# Altium project HVPCB.PrjPCB
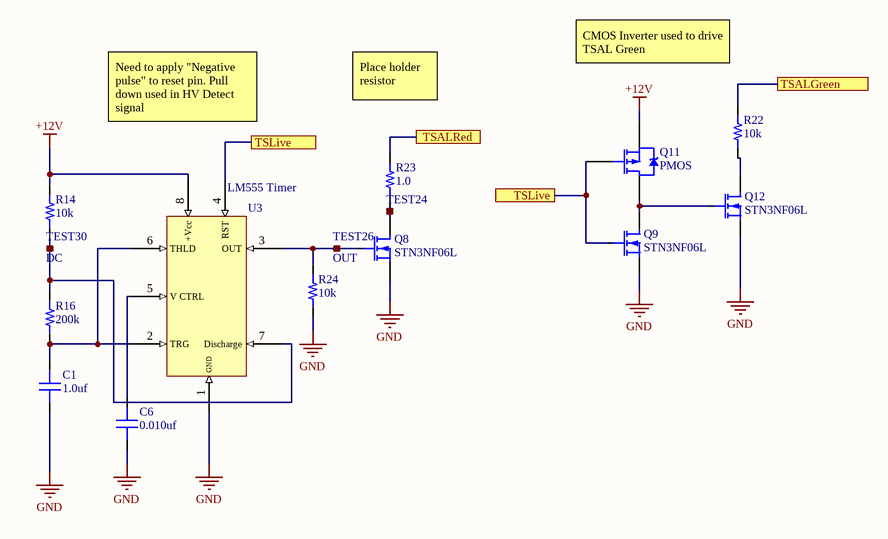
[diagram p0: LV.SchDoc]
4 sheets, 98 parts. Net scope: flat (ports and power ports of the same name join across sheets).
Board file: HVPCB_Rev2.PcbDoc
Sheets:
  LV.SchDoc
  Power_Rev2.SchDoc
  HVSchematic_Rev2.SchDoc
  Isolation_Rev2.SchDoc

## Sheet LV.SchDoc
size A

### Parts
C1  value 1.0uf  [CAP 0603/1608]  (hidden comment: Capacitor MLCC 1.0uf 16V CAP 0603/1608)
C6  value 0.010uf  [CAP 0402/1005]  (hidden comment: Capacitor MLCC 0.010uf 16V CAP 0402/1005)
Q8  STN3NF06L  [STN3NF06L]
Q9  STN3NF06L  [STN3NF06L]
Q11  PMOS  [SOT-23 (TO-236)]
Q12  STN3NF06L  [STN3NF06L]
R14  value 10k  [RES 0402/1005]  (hidden comment: Resistor 1.1 0402 1/10W 1%)
R16  value 200k  [RES 0603/1608]  (hidden comment: Resistor 200k 0603 1/10W 1%)
R22  value 10k  [RES 0402/1005]  (hidden comment: Resistor 10k 0402 1/10W 1%)
R23  value 1.0  [RES 0603/1608]  (hidden comment: Resistor 1.0 0603 1/10W 1%)
R24  value 10k  [RES 0402/1005]  (hidden comment: Resistor 10k 0402 1/10W 1%)
TEST24  (no value)  [RCU-0C]
TEST26  OUT  [RCU-0C]
TEST30  DC  [RCU-0C]
U3  LM555 Timer  [SOIC-8]

### Ports
TSALGreen, TSALRed, TSLive

### Nets
+12V: Q11.2(S) R14.2 U3.8(+Vcc)
GND: C1.1 C6.1 Q8.3(S) Q9.3(S) Q12.3(S) R24.1 U3.1(GND)
NetC1_2: C1.2 R16.1 U3.2(TRG) U3.6(THLD)
NetC6_2: C6.2 U3.5(V_CTRL)
NetP1_1: Q9.1(G) Q11.1(G) U3.4(RST) ; port TSLive
NetP1_2: R22.2 ; port TSALGreen
NetP1_3: R23.2 ; port TSALRed
NetQ8_1: Q8.1(G) R24.2 TEST26.1 U3.3(OUT)
NetQ8_2: Q8.2(D) R23.1 TEST24.1
NetQ9_2: Q9.2(D) Q11.3(D) Q12.1(G)
NetQ12_2: Q12.2(D) R22.1
NetR14_1: R14.1 R16.2 TEST30.1 U3.7(Discharge)

### Notes on the sheet
- (near R22) CMOS Inverter used to drive TSAL Green
- Need to apply "Negative pulse" to reset pin. Pull down used in HV Detect signal
- Place holder resistor

### Library data of the parts
C1 = 229: Manufacturer_id: 1; idCapacitor: 229; Name: Cap_1.0uf_16V_CAP 0603/1608; Dielectric: Ceramic; Created_By: Nick Mah; Drawer_id: 1; Voltage_Rating: 16V; Package: CAP 0603/1608; Created_Date: 10/20/2018
C6 = 97: Manufacturer_id: 1; idCapacitor: 97; Name: Cap_0.010uf_16V_CAP 0402/1005; Dielectric: Ceramic; Created_By: Nick Mah; Drawer_id: 1; Voltage_Rating: 16V; Package: CAP 0402/1005; Created_Date: 10/20/2018
Q8 Q9 Q12 = 8: MOSFET N-CH 60V 4A SOT223; Manufacturer_id: 1; idFETs: 8; Value: N_Channel; Rds_On: 70m; Vgs(Max): +/- 16V; Power(Max): 3.3W; Created_By: Graydon; Drawer_id: 1; Name: STN3NF06L; Vdss: 60V; Num_Circuits: 1; Id: 4A; Package: SOT-233; MfrPartNo: STN3NF06L; Link: https://www.digikey.com/product-detail/en/stmicroelectronics/STN3NF06L/497-3177-1-ND/654516; ComponentLink1Description: Datasheet; ComponentLink1URL: https://www.st.com/content/ccc/resource/technical/document/datasheet/b1/52/93/f0/a9/a9/40/d7/CD00002430.pdf/files/CD00002430.pdf/jcr:content/translations/en.CD00002430.pdf; Supplier1: Digkey; Supplier1PartNo: 497-3177-1-ND; Created_Date: 11/26/2018
Q11 = 12: P-Channel 60V 170mA (Ta) 360mW (Ta) Surface Mount SOT-23-3; Manufacturer_id: 1; idFuse: 3; idFETs: 12; Value: P_Channel; Rds_On: 8 Ohm; Vgs(typ): 2V; Vgs(Max): 20V; Power(Max): 350mW; Created_By: Angel; Drawer_id: 1; Name: BSS84PH6327XTSA2; Vdss: 60V; Num_Circuits: 1; Id: 170mA; Package: SOT-23-3; MfrPartNo: BSS84PH6327XTSA2; Link: https://www.digikey.com/product-detail/en/infineon-technologies/BSS84PH6327XTSA2/BSS84PH6327XTSA2DKR-ND/5413783; Supplier1: Digi-Key; Supplier1PartNo: BSS84PH6327XTSA2DKR-ND
R14 = 2: Manufacturer_id: 1; idResistor: 2; Name: Res_1.1_0402_1/10W_1%; Created_By: Nick Mah; Supplier 1: Digi-Key; Drawer_id: 1; Tolerance: 1%; Power: 1/10W; Package: 0402; ComponentLink1Description: Datasheet; Created_Date: 2018-10-20
R16 = 344: Manufacturer_id: 1; idResistor: 344; Name: Res_200k_0603_1/10W_1%; Created_By: Nick Mah; Supplier 1: Digi-Key; Drawer_id: 1; Tolerance: 1%; Power: 1/10W; Package: 0603; ComponentLink1Description: Datasheet; Created_Date: 2018-10-20
R22 R24 = 97: Manufacturer_id: 1; idResistor: 97; Name: Res_10k_0402_1/10W_1%; Created_By: Nick Mah; Supplier 1: Digi-Key; Drawer_id: 1; Tolerance: 1%; Power: 1/10W; Package: 0402; ComponentLink1Description: Datasheet; Created_Date: 2018-10-20
R23 = 217: Manufacturer_id: 1; idResistor: 217; Name: Res_1.0_0603_1/10W_1%; Created_By: Nick Mah; Supplier 1: Digi-Key; Drawer_id: 1; Tolerance: 1%; Power: 1/10W; Package: 0603; ComponentLink1Description: Datasheet; Created_Date: 2018-10-20
TEST24 TEST26 TEST30 = 14: Test point; Manufacturer_id: 1; idConn: 14; Value: CONN; Created_By: Graydon; Updated_By: Null; Drawer_id: 1; Name: RCU-0C; Num_Contacts: 1; Num_Rows: 1; Package: RCU-0C; MfrPartNo: RCU-0C; Link: https://www.digikey.com/product-detail/en/te-connectivity-amp-connectors/RCU-0C/A106145CT-ND/3477802; ComponentLink1Description: Null; ComponentLink1URL: Null; Supplier1: None; Supplier1PartNo: None; Created_Date: 11/10/2018
U3 = 17: Manufacturer_id: 1; idIC_Misc: 17; Drawer_id: 1; Name: LM555 Timer

## Sheet Power_Rev2.SchDoc
size A
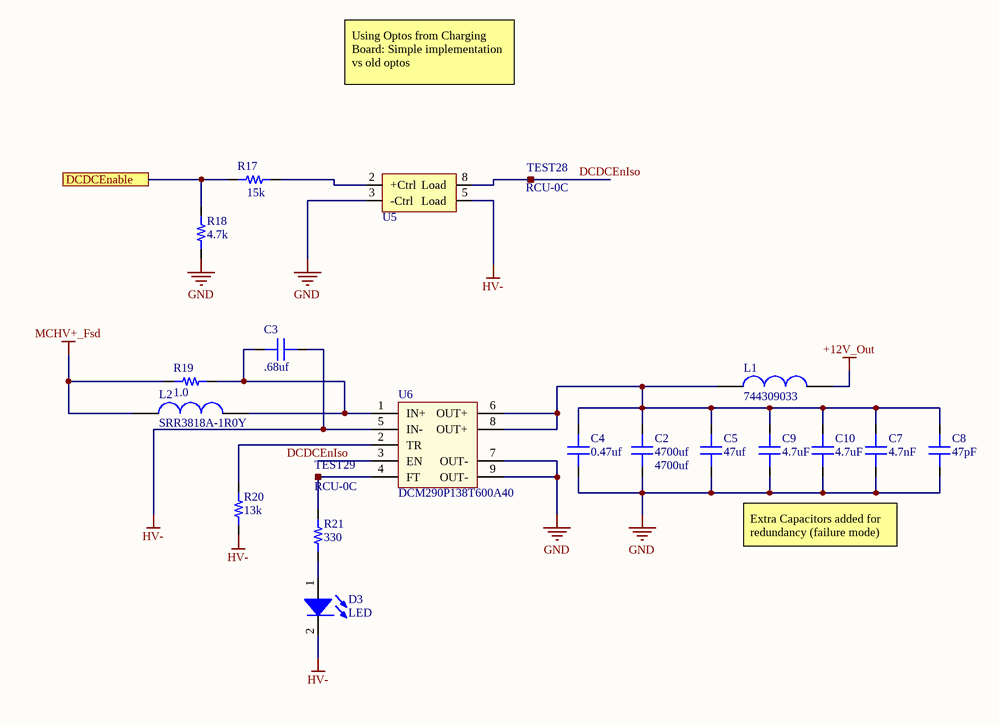
[diagram p1: Power_Rev2.SchDoc]

### Parts
C2  4700uf  [CAP AL TH D16 L7.5 H16.5]
C3  value .68uf  [ECW-FD2W684K-TH-CAP]  (hidden comment: HV Cap)
C4  value 0.47uf  [CAP 0603/1608]  (hidden comment: Capacitor MLCC 0.47uf 16V CAP 0603/1608)
C5  value 47uf  [CAP 0603/1608]  (hidden comment: Capacitor MLCC 47uf 16V CAP 0603/1608)
C7  value 4.7nF  [CAP 0603/1608]  (hidden comment: Capacitor MLCC 47uf 16V CAP 0603/1608)
C8  value 47pF  [CAP 0603/1608]  (hidden comment: Capacitor MLCC 47uf 16V CAP 0603/1608)
C9  value 4.7uF  [CAP 0603/1608]  (hidden comment: Capacitor MLCC 47uf 16V CAP 0603/1608)
C10  value 4.7uF  [CAP 0603/1608]  (hidden comment: Capacitor MLCC 47uf 16V CAP 0603/1608)
D3  LED  [0805_LED]
L1  744309033  [744309033]
L2  SRR3818A-1R0Y  [SRR3818A-1R0Y]
R17  value 15k  [RES 0603/1608]  (hidden comment: Resistor 3.0k 0603 1/10W 1%)
R18  value 4.7k  [RES 0603/1608]  (hidden comment: Resistor 4.7k 0603 1/10W 1%)
R19  value 1.0  [RES 0603/1608]  (hidden comment: Resistor 1.0 0603 1/10W 1%)
R20  value 13k  [RES 0603/1608]  (hidden comment: Resistor 13k 0603 1/10W 1%)
R21  value 330  [RES 0603/1608]  (hidden comment: Resistor 330 0603 1/10W 1%)
TEST28  RCU-0C  [RCU-0C]
TEST29  RCU-0C  [RCU-0C]
U5  SSR NC  [PLB171P]  (value not drawn)
U6  DCM290P138T600A40  [DCM290P138T600A40]

### Ports
DCDCEnable

### Nets
+12V_Out: L1.2
GND: C2.2 C4.1 C5.2 C7.2 C8.2 C9.2 C10.2 R18.1 U5.3(-Ctrl) U6.7(OUT-) U6.9(OUT-)
HV-: C3.1 D3.2(K) R20.1 U5.5(Load) U6.5(IN-)
MCHV+_Fsd: L2.1 R19.1
DCDCEnIso: TEST28.1 U5.8(Load) U6.3(EN)
NetC2_1: C2.1 C4.2 C5.1 C7.1 C8.1 C9.1 C10.1 L1.1 U6.6(OUT+) U6.8(OUT+)
NetC3_2: C3.2 L2.2 R19.2 U6.1(IN+)
NetD3_1: D3.1(A) R21.1
NetP1_6: R17.1 R18.2 ; port DCDCEnable
NetR17_2: R17.2 U5.2(+Ctrl)
NetR20_2: R20.2 U6.2(TR)
NetR21_2: R21.2 TEST29.1 U6.4(FT)

### Notes on the sheet
- Using Optos from Charging Board: Simple implementation vs old optos
- Extra Capacitors added for redundancy (failure mode) and to reduce noise

### Library data of the parts
C2 = 1083: Manufacturer_id: 1; MfrPartNo: UVZ1E472MHD; idCapacitor: 1083; Name: Cap_4700uf_25V_CAP TH; Voltage_Rating: 25V; Tolerance: 20%; Created_By: Angel Delgado; Value: 4700uf; Drawer_id: 1; Package: TH; Link: https://www.digikey.com/product-detail/en/nichicon/UVZ1E472MHD/493-1308-ND/589049; ComponentLink1Description: Datasheet
C3 = 1082: Manufacturer_id: 1; MfrPartNo: ECW-FD2W684K; idCapacitor: 1082; Name: Cap_.68uf_450V_CAP TH; Voltage_Rating: 450V; Dielectric: Polypropylene; Tolerance: 10%; Created_By: Angel Delgado; Drawer_id: 1; Package: TH; Link: https://www.mouser.com/ProductDetail/Panasonic/ECW-FD2W684K?qs=sGAEpiMZZMsh%252b1woXyUXj8Oz95SkSMnKDNbVTfkAU30%3d; ComponentLink1Description: Datasheet
C4 = 227: Manufacturer_id: 1; idCapacitor: 227; Name: Cap_0.47uf_16V_CAP 0603/1608; Dielectric: Ceramic; Created_By: Nick Mah; Drawer_id: 1; Voltage_Rating: 16V; Package: CAP 0603/1608; Created_Date: 10/20/2018
C5 C7-C10 = 239: Manufacturer_id: 1; idCapacitor: 239; Name: Cap_47uf_16V_CAP 0603/1608; Dielectric: Ceramic; Created_By: Nick Mah; Drawer_id: 1; Voltage_Rating: 16V; Package: CAP 0603/1608; Created_Date: 10/20/2018
D3 = 1: idLED: 1; Name: LED_0805_RED; Value: Red; Vf: 0.7V; Manufacturer_id: 1; Drawer_id: 1; Package: 0805
L1 = 3: 330nH wirewound inductor; Manufacturer_id: 1; idInductor: 3; Created_By: Graydon; Drawer_id: 1; Name: 744309033; Value: 330nH; Package: Nonstandard; MfrPartNo: 744309033; Link: https://www.digikey.com/product-detail/en/wurth-electronics-inc/744309033/732-3006-1-ND/2626130; Supplier1: Digikey; Supplier1PartNo: 732-3006-1-ND; Created_Date: 11/12/2018
L2 = 4: 1uH fixed inductor; Manufacturer_id: 1; idInductor: 4; Created_By: Graydon; Drawer_id: 1; Name: SRR3818A-1R0Y; Value: 1uH; Package: Nonstandard; MfrPartNo: SRR3818A-1R0Y; Link: https://www.mouser.com/ProductDetail/Bourns/SRR3818A-1R0Y?qs=EU6FO9ffTwdCQ1wGwZI3iw%3D%3D; ComponentLink1Description: Mouser; ComponentLink1URL: https://www.mouser.com/ProductDetail/Bourns/SRR3818A-1R0Y?qs=EU6FO9ffTwdCQ1wGwZI3iw%3D%3D; Supplier1: Mouser; Supplier1PartNo: 652-SRR3818A-1R0Y; Created_Date: 11/12/2018
R17 = 300: Manufacturer_id: 1; idResistor: 300; Name: Res_3.0k_0603_1/10W_1%; Created_By: Nick Mah; Supplier 1: Digi-Key; Drawer_id: 1; Tolerance: 1%; Power: 1/10W; Package: 0603; ComponentLink1Description: Datasheet; Created_Date: 2018-10-20
R18 = 305: Manufacturer_id: 1; idResistor: 305; Name: Res_4.7k_0603_1/10W_1%; Created_By: Nick Mah; Supplier 1: Digi-Key; Drawer_id: 1; Tolerance: 1%; Power: 1/10W; Package: 0603; ComponentLink1Description: Datasheet; Created_Date: 2018-10-20
R19 = 217: as R23 on sheet LV; Supplier 1: Digi-Key; Drawer_id: 1; Tolerance: 1%; Power: 1/10W; Package: 0603; ComponentLink1Description: Datasheet; Created_Date: 2018-10-20
R20 = 316: Manufacturer_id: 1; idResistor: 316; Name: Res_13k_0603_1/10W_1%; Created_By: Nick Mah; Supplier 1: Digi-Key; Drawer_id: 1; Tolerance: 1%; Power: 1/10W; Package: 0603; ComponentLink1Description: Datasheet; Created_Date: 2018-10-20
R21 = 277: Manufacturer_id: 1; idResistor: 277; Name: Res_330_0603_1/10W_1%; Created_By: Nick Mah; Supplier 1: Digi-Key; Drawer_id: 1; Tolerance: 1%; Power: 1/10W; Package: 0603; ComponentLink1Description: Datasheet; Created_Date: 2018-10-20
TEST28 TEST29 = 14: as TEST24 on sheet LV; Drawer_id: 1; Name: RCU-0C; Num_Contacts: 1; Num_Rows: 1; Package: RCU-0C; MfrPartNo: RCU-0C; Link: https://www.digikey.com/product-detail/en/te-connectivity-amp-connectors/RCU-0C/A106145CT-ND/3477802; ComponentLink1Description: Null; ComponentLink1URL: Null; Supplier1: None; Supplier1PartNo: None; Created_Date: 11/10/2018
U5 = 34: Optoisolator: solid state relay, normally closed; Manufacturer_id: 1; idIC_Misc: 34; Created_By: gray; Drawer_id: 1; Name: PLB171; Type: Optoisolator; Num_Circuits: 1; Package: PLB171P; MfrPartNo: PLB171P; Link: https://www.digikey.com/product-detail/en/ixys-integrated-circuits-division/PLB171P/PLB171P-ND/5887143; ComponentLink1Description: Digikey; ComponentLink1URL: https://www.digikey.com/product-detail/en/ixys-integrated-circuits-division/PLB171P/PLB171P-ND/5887143; Supplier1: Digikey; Supplier1PartNo: PLB171P-ND; Created_Date: 3/8/2019
U6 = 24: Vicor DC/DC converter; Manufacturer_id: 1; idIC_Misc: 24; Value: Null; Created_By: Graydon; Drawer_id: 1; Name: DCM290P138T600A40; Type: Null; Protocol: Null; Num_Circuits: 1; Data_Rate: Null; Vin(Min): Null; Vin(Max): Null; MfrPartNo: DCM290P138T600A40; Link: http://www.vicorpower.com/documents/datasheets/ds_DCM290y138x600A40.pdf; Supplier1: Digikey; Supplier1PartNo: 1102-5388-ND

## Sheet HVSchematic_Rev2.SchDoc
size A
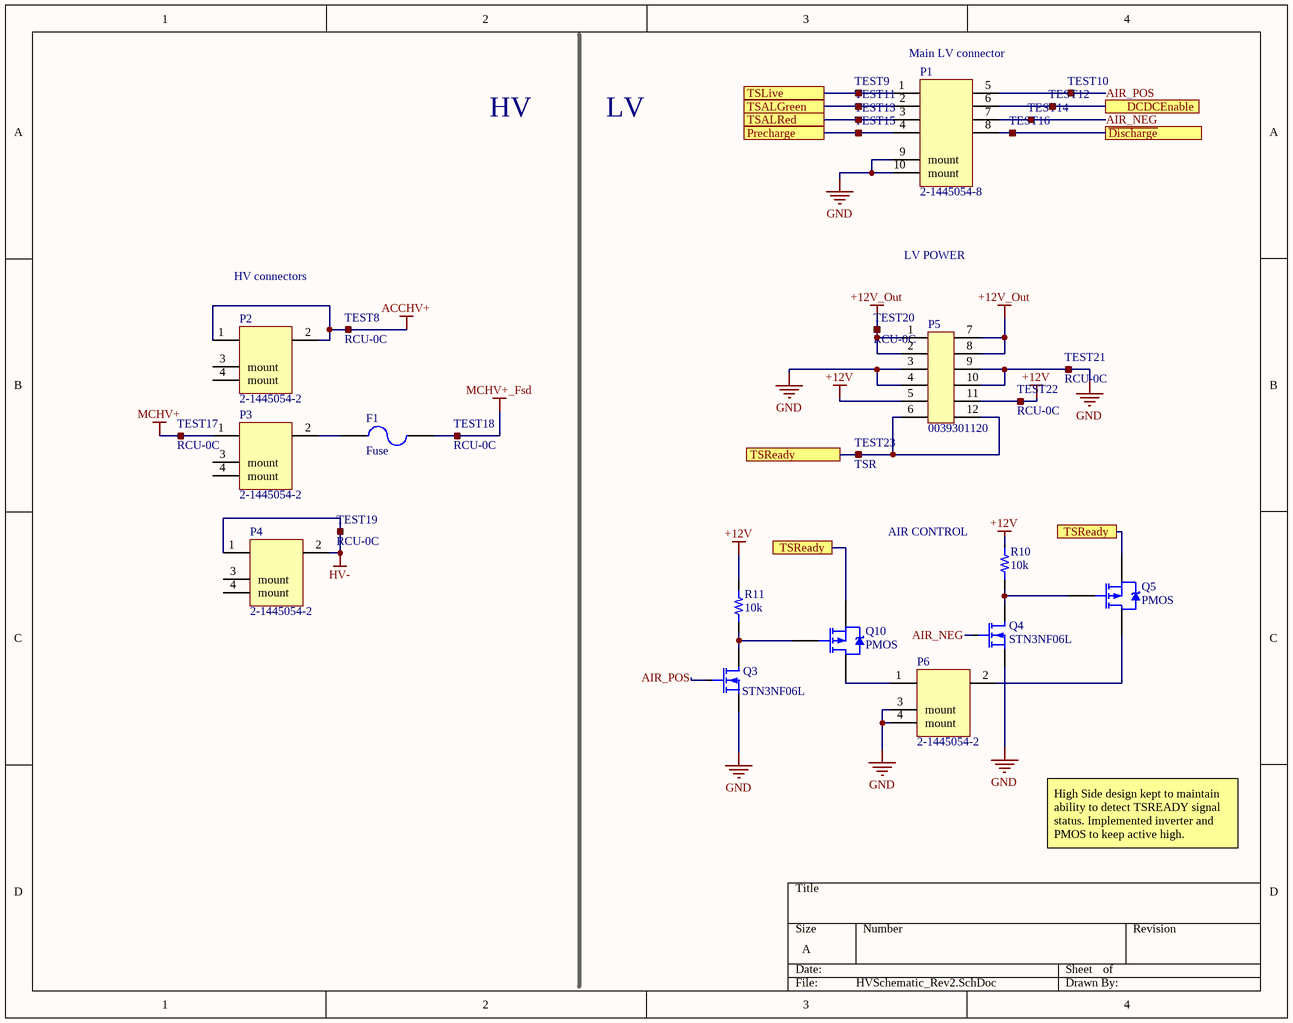
[diagram p2: HVSchematic_Rev2.SchDoc]

### Parts
F1  Fuse  [0885004.DR]
P1  2-1445054-8  [2-1445054-8]
P2  2-1445054-2  [2-1445054-2]
P3  2-1445054-2  [2-1445054-2]
P4  2-1445054-2  [2-1445054-2]
P5  0039301120  [0039301120]
P6  2-1445054-2  [2-1445054-2]
Q3  STN3NF06L  [STN3NF06L]
Q4  STN3NF06L  [STN3NF06L]
Q5  PMOS  [SOT-23 (TO-236)]
Q10  PMOS  [SOT-23 (TO-236)]
R10  value 10k  [RES 0402/1005]  (hidden comment: Resistor 1.0 0402 1/10W 1%)
R11  value 10k  [RES 0402/1005]  (hidden comment: Resistor 1.0 0402 1/10W 1%)
TEST8  RCU-0C  [RCU-0C]
TEST9  TSL  [RCU-0C]  (value not drawn)
TEST10  AIR_POS  [RCU-0C]  (value not drawn)
TEST11  TSALGreen Out  [RCU-0C]  (value not drawn)
TEST12  RCU-0C  [RCU-0C]  (value not drawn)
TEST13  TSRED  [RCU-0C]  (value not drawn)
TEST14  AIR_NEG  [RCU-0C]  (value not drawn)
TEST15  PC  [RCU-0C]  (value not drawn)
TEST16  DC  [RCU-0C]  (value not drawn)
TEST17  RCU-0C  [RCU-0C]
TEST18  RCU-0C  [RCU-0C]
TEST19  RCU-0C  [RCU-0C]
TEST20  RCU-0C  [RCU-0C]
TEST21  RCU-0C  [RCU-0C]
TEST22  RCU-0C  [RCU-0C]
TEST23  TSR  [RCU-0C]

### Ports
DCDCEnable, Precharge, TSALGreen, TSALRed, TSLive, TSReady, ~{Discharge}

### Nets
+12V: P5.5 P5.11 R10.2 R11.2 TEST22.1
+12V_Out: P5.1 P5.2 P5.7 P5.8 TEST20.1
ACCHV+: P2.1 P2.2 TEST8.1
GND: P1.9(mount) P1.10(mount) P5.3 P5.4 P5.9 P5.10 P6.3(mount) P6.4(mount) Q3.3(S) Q4.3(S) TEST21.1
HV-: P4.1 P4.2 TEST19.1
MCHV+: P3.1 TEST17.1
MCHV+_Fsd: F1.2 TEST18.1
AIR_NEG: P1.7 Q4.1(G) TEST14.1
AIR_POS: P1.5 Q3.1(G) TEST10.1
NetF1_1: F1.1 P3.2
NetP1_1: P1.1 TEST9.1 ; port TSLive
NetP1_2: P1.2 TEST11.1 ; port TSALGreen
NetP1_3: P1.3 TEST13.1 ; port TSALRed
NetP1_4: P1.4 TEST15.1 ; port Precharge
NetP1_6: P1.6 TEST12.1 ; port DCDCEnable
NetP1_8: P1.8 TEST16.1 ; port ~{Discharge}
NetP5_6: P5.6 P5.12 Q5.2(S) Q10.2(S) TEST23.1 ; port TSReady
NetP6_1: P6.1 Q10.3(D)
NetP6_2: P6.2 Q5.3(D)
NetQ3_2: Q3.2(D) Q10.1(G) R11.1
NetQ4_2: Q4.2(D) Q5.1(G) R10.1

Not connected (* = marked no-connect by the designer): P2 3(mount) 4(mount); P3 3(mount) 4(mount); P4 3(mount) 4(mount)

### Notes on the sheet
- (near P1) Main LV connector
- HV
- LV
- HV connectors
- LV POWER
- AIR CONTROL
- High Side design kept to maintain ability to detect TSREADY signal status. Implemented inverter and PMOS to keep active high.

### Library data of the parts
F1 = 7: Manufacturer_id: 1; idFuse: 7; Value: 4A; V_max: 450VDC; Pd_Typ: 316mW; Created_By: Graydon; Drawer_id: 1; Name: 0885004.DR; I_hold: 4A; MfrPartNo: 0885004.DR; Link: https://www.digikey.com/product-detail/en/littelfuse-inc/0885004.DR/F10991CT-ND/8345705; Created_Date: 11/12/2018
P1 = 12: 1x8 connector; Manufacturer_id: 5; idConn: 12; Drawer_id: 1; Name: Micro MATE-N-LOK 1x8; Num_Contacts: 8; Created_By: Graydon; Num_Rows: 1; MfrPartNo: 2-1445054-8; Link: https://www.digikey.com/product-detail/en/te-connectivity-amp-connectors/2-1445054-8/2-1445054-8-ND/1890093; ComponentLink1Description: Datasheet; Supplier1: Digi-Key; Supplier1PartNo: 2-1445054-8-ND; Created_Date: 11/10/2018
P2-P4 P6 = 16: 1x2 connector; Manufacturer_id: 5; idConn: 16; Drawer_id: 1; Name: Micro MATE-N-LOK 1x2; Voltage_Rating: Null; Num_Contacts: 2; Created_By: Graydon; Num_Rows: 1; Pitch: Null; MfrPartNo: 2-1445054-2; Link: https://www.digikey.com/products/en?keywords=2-1445054-2; ComponentLink1Description: Digikey; ComponentLink1URL: Null; Supplier1: Digi-Key; Supplier1PartNo: 2-1445054-2-ND; Created_Date: 11/12/2018; Updated_By: Null
P5 = 20: Molex Minifit Jr 12p right angle; Manufacturer_id: 1; idConn: 20; Value: CONN; Num_Contacts: 12; Num_Rows: 2; Created_By: Graydon; Drawer_id: 1; Name: Minifit Jr 12p; MfrPartNo: 0039301120; Link: https://www.digikey.com/product-detail/en/molex-llc/0039301120/WM1356-ND/561083; ComponentLink1Description: Datasheet; ComponentLink1URL: https://www.molex.com/pdm_docs/sd/039301120_sd.pdf; Supplier1: Digi-Key; Supplier1PartNo: https://www.digikey.com/product-detail/en/molex-llc/0039301120/WM1356-ND/561083; Created_Date: 11/28/2018
Q3 Q4 = 8: as Q8 on sheet LV; Drawer_id: 1; Name: STN3NF06L; Vdss: 60V; Num_Circuits: 1; Id: 4A; Package: SOT-233; MfrPartNo: STN3NF06L; Link: https://www.digikey.com/product-detail/en/stmicroelectronics/STN3NF06L/497-3177-1-ND/654516; ComponentLink1Description: Datasheet; ComponentLink1URL: https://www.st.com/content/ccc/resource/technical/document/datasheet/b1/52/93/f0/a9/a9/40/d7/CD00002430.pdf/files/CD00002430.pdf/jcr:content/translations/en.CD00002430.pdf; Supplier1: Digkey; Supplier1PartNo: 497-3177-1-ND; Created_Date: 11/26/2018
Q5 Q10 = 12: as Q11 on sheet LV; Drawer_id: 1; Name: BSS84PH6327XTSA2; Vdss: 60V; Num_Circuits: 1; Id: 170mA; Package: SOT-23-3; MfrPartNo: BSS84PH6327XTSA2; Link: https://www.digikey.com/product-detail/en/infineon-technologies/BSS84PH6327XTSA2/BSS84PH6327XTSA2DKR-ND/5413783; Supplier1: Digi-Key; Supplier1PartNo: BSS84PH6327XTSA2DKR-ND
R10 R11 = 1: idResistor: 1; Name: Res_1.0_0402_1/10W_1%; Created_By: Nick Mah; Supplier 1: Digi-Key; Manufacturer_id: 1; Drawer_id: 1; Tolerance: 1%; Power: 1/10W; Package: 0402; ComponentLink1Description: Datasheet; Created_Date: 2018-10-20
TEST8-TEST23 = 14: as TEST24 on sheet LV; Drawer_id: 1; Name: RCU-0C; Num_Contacts: 1; Num_Rows: 1; Package: RCU-0C; MfrPartNo: RCU-0C; Link: https://www.digikey.com/product-detail/en/te-connectivity-amp-connectors/RCU-0C/A106145CT-ND/3477802; ComponentLink1Description: Null; ComponentLink1URL: Null; Supplier1: None; Supplier1PartNo: None; Created_Date: 11/10/2018

## Sheet Isolation_Rev2.SchDoc
size A
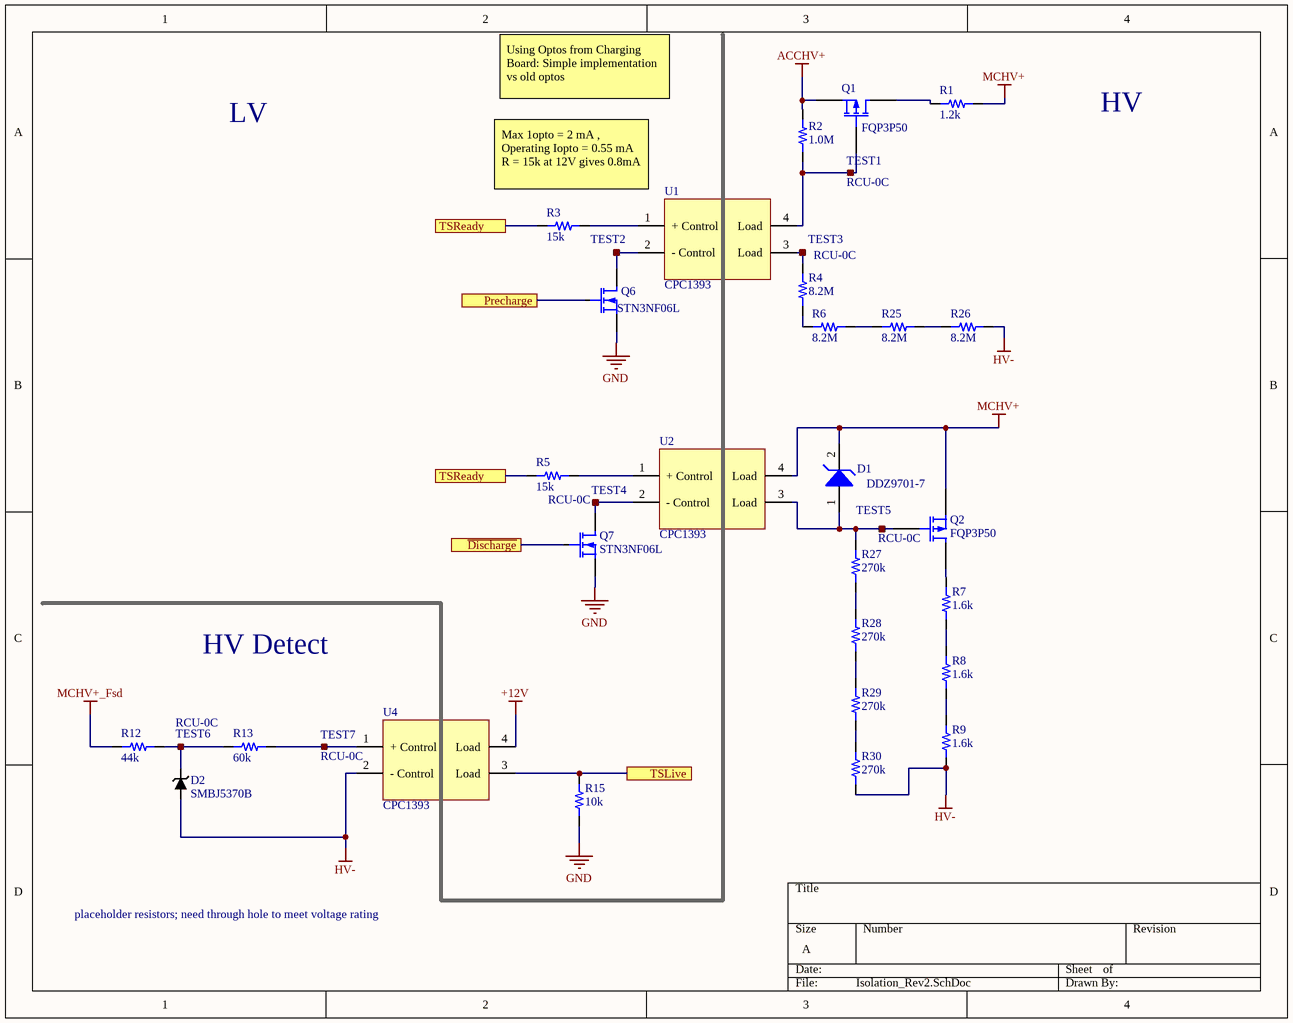
[diagram p3: Isolation_Rev2.SchDoc]

### Parts
D1  DDZ9701-7  [SOD123F]
D2  SMBJ5370B  [SMBJ5370B-TP]
Q1  FQP3P50  [TO-220AB]
Q2  FQP3P50  [TO-220AB]
Q6  STN3NF06L  [STN3NF06L]
Q7  STN3NF06L  [STN3NF06L]
R1  value 1.2k  [AP101]  (hidden comment: Resistor 1k2 100W 1% Throughhole)
R2  value 1.0M  [RES 0603/1608]  (hidden comment: Resistor 1.0M 0603 1/10W 10%)
R3  value 15k  [RES 0603/1608]  (hidden comment: Resistor 3.0k 0603 1/10W 1%)
R4  value 8.2M  [RES 0805/2012]  (hidden comment: Resistor 8.2M 0805 1/4W 5%)
R5  value 15k  [RES 0603/1608]  (hidden comment: Resistor 3.0k 0603 1/10W 1%)
R6  value 8.2M  [RES 0805/2012]  (hidden comment: Resistor 8.2M 0805 1/4W 5%)
R7  value 1.6k  [Axial 52mm Pitch]  (hidden comment: Resistor 1.6k Axial 10W 5%)
R8  value 1.6k  [Axial 52mm Pitch]  (hidden comment: Resistor 1.6k Axial 10W 5%)
R9  value 1.6k  [Axial 52mm Pitch]  (hidden comment: Resistor 1.6k Axial 10W 5%)
R12  value 44k  [Axial 25.4mm Pitch]  (hidden comment: Resistor 2W TH)
R13  value 60k  [Axial 25.4mm Pitch]  (hidden comment: Resistor 2W TH)
R15  value 10k  [RES 0603/1608]  (hidden comment: Resistor 4.7k 0603 1/10W 5%)
R25  value 8.2M  [RES 0805/2012]  (hidden comment: Resistor 8.2M 0805 1/4W 5%)
R26  value 8.2M  [RES 0805/2012]  (hidden comment: Resistor 8.2M 0805 1/4W 5%)
R27  value 270k  [RES 0805/2012]  (hidden comment: Resistor 270k 0805 1/4W 5%)
R28  value 270k  [RES 0805/2012]  (hidden comment: Resistor 270k 0805 1/4W 5%)
R29  value 270k  [RES 0805/2012]  (hidden comment: Resistor 270k 0805 1/4W 5%)
R30  value 270k  [RES 0805/2012]  (hidden comment: Resistor 270k 0805 1/4W 5%)
TEST1  RCU-0C  [RCU-0C]
TEST2  (no value)  [RCU-0C]
TEST3  RCU-0C  [RCU-0C]
TEST4  RCU-0C  [RCU-0C]
TEST5  RCU-0C  [RCU-0C]
TEST6  RCU-0C  [RCU-0C]
TEST7  RCU-0C  [RCU-0C]
U1  CPC1393  [CPC1393GR]
U2  CPC1393  [CPC1393GR]
U4  CPC1393  [CPC1393GR]

### Ports
Precharge, TSLive, TSReady, ~{Discharge}

### Nets
+12V: U4.4(Load)
ACCHV+: Q1.3(S) R2.1
GND: Q6.3(S) Q7.3(S) R15.1
HV-: D2.1 R9.1 R26.1 R30.1 U4.2(-_Control)
MCHV+: D1.2(K) Q2.3(S) R1.2 U2.4(Load)
MCHV+_Fsd: R12.1
NetD1_1: D1.1(A) Q2.1(G) R27.2 TEST5.1 U2.3(Load)
NetD2_2: D2.2 R12.2 R13.1 TEST6.1
NetP1_1: R15.2 U4.3(Load) ; port TSLive
NetP1_4: Q6.1(G) ; port Precharge
NetP1_8: Q7.1(G) ; port ~{Discharge}
NetP5_6: R3.1 R5.1 ; port TSReady
NetQ1_1: Q1.1(G) R2.2 TEST1.1 U1.4(Load)
NetQ1_2: Q1.2(D) R1.1
NetQ2_2: Q2.2(D) R7.2
NetQ6_2: Q6.2(D) TEST2.1 U1.2(-_Control)
NetQ7_2: Q7.2(D) TEST4.1 U2.2(-_Control)
NetR3_2: R3.2 U1.1(+_Control)
NetR4_1: R4.1 R6.2
NetR4_2: R4.2 TEST3.1 U1.3(Load)
NetR5_2: R5.2 U2.1(+_Control)
NetR6_1: R6.1 R25.2
NetR7_1: R7.1 R8.2
NetR8_1: R8.1 R9.2
NetR13_2: R13.2 TEST7.1 U4.1(+_Control)
NetR25_1: R25.1 R26.2
NetR27_1: R27.1 R28.2
NetR28_1: R28.1 R29.2
NetR29_1: R29.1 R30.2

### Notes on the sheet
- Using Optos from Charging Board: Simple implementation vs old optos
- LV
- HV
- Max 1opto = 2 mA ,          Operating Iopto = 0.55 mA
  R = 15k at 12V gives 0.8mA
- HV Detect
- placeholder resistors; need through hole to meet voltage rating

### Library data of the parts
D1 = 10: Zener Diode 14V 500mW ±5% Surface Mount SOD-123; Manufacturer_id: 8; idDiode: 10; Drawer_id: 1; Value: 14Vz; MfrPartNo: DDZ9701-7; Name: DDZ9701; Type: Zener; Num_Circuits: 1; Power: 500mW; Package: SOD-123; Link: https://www.digikey.com/product-detail/en/diodes-incorporated/DDZ9701-7/DDZ9701-7DICT-ND/3877402; ComponentLink1Description: Datasheet; ComponentLink1URL: https://www.diodes.com/assets/Datasheets/ds30410.pdf; Supplier1: Digi-Key; Supplier1PartNo: DDZ9701-7DICT-ND
D2 = 13: 56V Zener Diode; Manufacturer_id: 1; idDiode: 13; Created_By: Graydon; Drawer_id: 1; Name: SMBJ5370B-TP; Value: 56V; Type: Zener; Num_Circuits: 1; Link: https://www.digikey.com/product-detail/en/micro-commercial-co/SMBJ5370B-TP/SMBJ5370B-TPMSCT-ND/3165257; ComponentLink1Description: Digikey; ComponentLink1URL: https://www.digikey.com/product-detail/en/micro-commercial-co/SMBJ5370B-TP/SMBJ5370B-TPMSCT-ND/3165257; Supplier1: Digikey; Supplier1PartNo: SMBJ5370B-TPMSCT-ND
Q1 Q2 = 5: Manufacturer_id: 1; idFETs: 5; Value: P_Channel; Vdss: 500V; Id: 2.7A; Rds_On: 4Ohms; Vgs(typ): 4.0v; Vgs(Max): 5.0V; Power(Max): 85W; Created_By: Angel; Drawer_id: 1; Name: FQP3P50; Num_Circuits: 1; Package: TO-220; MfrPartNo: FQP3P50; Link: https://www.digikey.com/product-detail/en/on-semiconductor/FQP3P50/FQP3P50-ND/1055021; Supplier1: Digi-Key; Supplier1PartNo: FQP3P50-ND
Q6 Q7 = 8: as Q8 on sheet LV; Drawer_id: 1; Name: STN3NF06L; Vdss: 60V; Num_Circuits: 1; Id: 4A; Package: SOT-233; MfrPartNo: STN3NF06L; Link: https://www.digikey.com/product-detail/en/stmicroelectronics/STN3NF06L/497-3177-1-ND/654516; ComponentLink1Description: Datasheet; ComponentLink1URL: https://www.st.com/content/ccc/resource/technical/document/datasheet/b1/52/93/f0/a9/a9/40/d7/CD00002430.pdf/files/CD00002430.pdf/jcr:content/translations/en.CD00002430.pdf; Supplier1: Digkey; Supplier1PartNo: 497-3177-1-ND; Created_Date: 11/26/2018
R1 = 2705: 100W Throughhole Resistor; Manufacturer_id: 1; idResistor: 2705; Name: AP101 1K2 J; Tolerance: 5%; Created_By: Graydon; Supplier 1: Digi-Key; Supplier Part Number 1: AP1011K2J-ND; Drawer_id: 1; Power: 100W; Package: TO-247-2; MfrPartNo: AP101 1K2 J; Link: https://www.digikey.com/short/jvdcjz; ComponentLink1Description: Datasheet; ComponentLink1URL: https://www.ohmite.com/assets/docs/acl_ap101.pdf?r=false; Created_Date: 2018-11-24
R2 = 2341: Manufacturer_id: 1; idResistor: 2341; Name: Res_1.0M_0603_1/10W_10%; Created_By: Nick Mah; Supplier 1: Digi-Key; Drawer_id: 1; Tolerance: 10%; Power: 1/10W; Package: 0603; ComponentLink1Description: Datasheet; Created_Date: 2018-10-20
R3 R5 = 300: as R17 on sheet Power_Rev2; Supplier 1: Digi-Key; Drawer_id: 1; Tolerance: 1%; Power: 1/10W; Package: 0603; ComponentLink1Description: Datasheet; Created_Date: 2018-10-20
R4 R6 R25 R26 = 1895: Manufacturer_id: 1; idResistor: 1895; Name: Res_8.2M_0805_1/4W_5%; Created_By: Nick Mah; Supplier 1: Digi-Key; Drawer_id: 1; Tolerance: 5%; Power: 1/4W; Package: 0805; ComponentLink1Description: Datasheet; Created_Date: 2018-10-20
R7-R9 = 2706: Manufacturer_id: 1; MfrPartNo: SQP10AJB-1K6; idResistor: 2706; Name: Res_1.6k_Axial_10W_5%; Supplier 1: Digi-Key; Supplier Part Number 1: Digi-Key; Drawer_id: 1; Tolerance: 5%; Power: 10W; Package: Axial; Link: https://www.digikey.com/product-detail/en/yageo/SQP10AJB-1K6/1.6KW-10-ND/18787; ComponentLink1Description: Datasheet
R12 R13 = 2707: 2W TH resistor; Manufacturer_id: 1; idResistor: 2707; Name: PR02; Tolerance: 5%; Created_By: Graydon; Supplier Part Number 1: Digi-Key; Drawer_id: 1; Power: 2W; Package: Axial; Link: https://www.digikey.com/product-detail/en/vishay-bc-components/PR02000205101JR500/PPC5.1KW-2CT-ND/597417; ComponentLink1Description: Datasheet; Created_Date: 2018-12-01
R15 = 1385: Manufacturer_id: 1; idResistor: 1385; Name: Res_4.7k_0603_1/10W_5%; Created_By: Nick Mah; Supplier 1: Digi-Key; Drawer_id: 1; Tolerance: 5%; Power: 1/10W; Package: 0603; ComponentLink1Description: Datasheet; Created_Date: 2018-10-20
R27-R30 = 1859: Manufacturer_id: 1; idResistor: 1859; Name: Res_270k_0805_1/4W_5%; Created_By: Nick Mah; Supplier 1: Digi-Key; Drawer_id: 1; Tolerance: 5%; Power: 1/4W; Package: 0805; ComponentLink1Description: Datasheet; Created_Date: 2018-10-20
TEST1-TEST7 = 14: as TEST24 on sheet LV; Drawer_id: 1; Name: RCU-0C; Num_Contacts: 1; Num_Rows: 1; Package: RCU-0C; MfrPartNo: RCU-0C; Link: https://www.digikey.com/product-detail/en/te-connectivity-amp-connectors/RCU-0C/A106145CT-ND/3477802; ComponentLink1Description: Null; ComponentLink1URL: Null; Supplier1: None; Supplier1PartNo: None; Created_Date: 11/10/2018
U1 U2 U4 = 26: Solid State Relay SPST-NO (1 Form A) 4-SMD (0.300", 7.62mm); Manufacturer_id: 1; MfrPartNo: CPC1393GRTR; idIC_Misc: 26; Value: Null; Created_By: Lynette; Drawer_id: 1; Name: CPC1393; Type: Null; Protocol: Null; Num_Circuits: 1; Data_Rate: Null; Vin(Min): Null; Vin(Max): Null; Package: CPC1393GR; Link: https://www.digikey.com/product-detail/en/ixys-integrated-circuits-division/CPC1393GRTR/CLA270CT-ND/1277144; ComponentLink1Description: Null; ComponentLink1URL: Null; Supplier1: Null; Supplier1PartNo: Null; Updated_By: Null

## Nets that join several sheets
+12V: LV (Q11.2 R14.2 U3.8), HVSchematic_Rev2 (5 pins), Isolation_Rev2 (U4.4)
+12V_Out: Power_Rev2 (L1.2), HVSchematic_Rev2 (5 pins)
ACCHV+: HVSchematic_Rev2 (P2.1 P2.2 TEST8.1), Isolation_Rev2 (Q1.3 R2.1)
GND: LV (7 pins), Power_Rev2 (11 pins), HVSchematic_Rev2 (11 pins), Isolation_Rev2 (Q6.3 Q7.3 R15.1)
HV-: Power_Rev2 (5 pins), HVSchematic_Rev2 (P4.1 P4.2 TEST19.1), Isolation_Rev2 (5 pins)
MCHV+: HVSchematic_Rev2 (P3.1 TEST17.1), Isolation_Rev2 (D1.2 Q2.3 R1.2 U2.4)
MCHV+_Fsd: Power_Rev2 (L2.1 R19.1), HVSchematic_Rev2 (F1.2 TEST18.1), Isolation_Rev2 (R12.1)
NetP1_1: LV (Q9.1 Q11.1 U3.4), HVSchematic_Rev2 (P1.1 TEST9.1), Isolation_Rev2 (R15.2 U4.3)
NetP1_2: LV (R22.2), HVSchematic_Rev2 (P1.2 TEST11.1)
NetP1_3: LV (R23.2), HVSchematic_Rev2 (P1.3 TEST13.1)
NetP1_4: HVSchematic_Rev2 (P1.4 TEST15.1), Isolation_Rev2 (Q6.1)
NetP1_6: Power_Rev2 (R17.1 R18.2), HVSchematic_Rev2 (P1.6 TEST12.1)
NetP1_8: HVSchematic_Rev2 (P1.8 TEST16.1), Isolation_Rev2 (Q7.1)
NetP5_6: HVSchematic_Rev2 (5 pins), Isolation_Rev2 (R3.1 R5.1)